# EAGLE design fingertip_16line_2 (EAGLE 9.6.2)
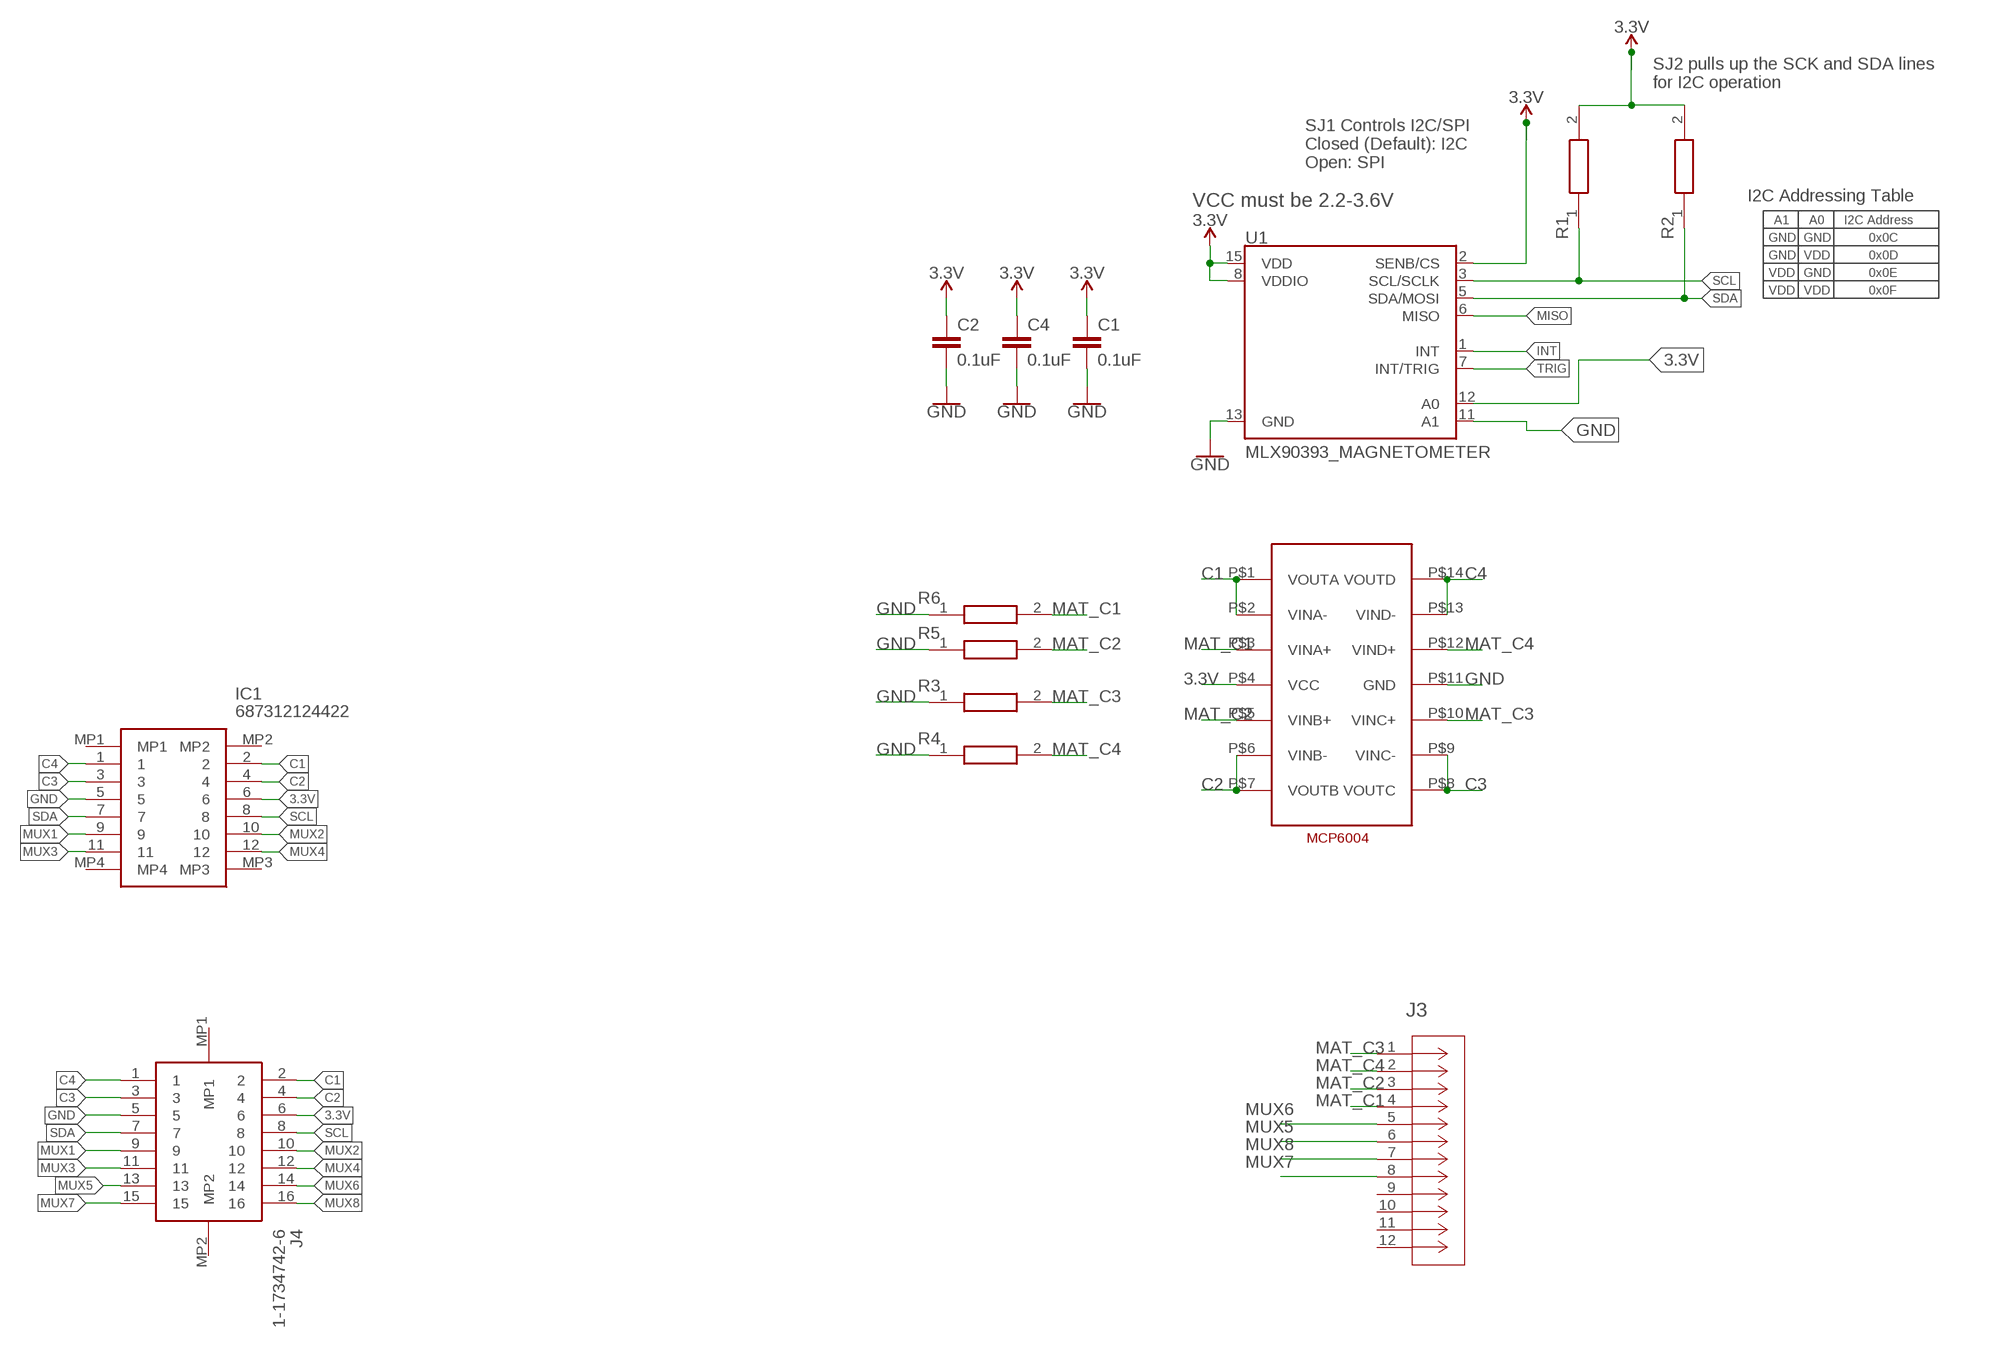
[diagram p0: schematic, sheet 1]

## Parts
C1  0.1uF  0.1UF-0402-16V-10%  [0402]
C2  0.1uF  0.1UF-0402-16V-10%  [0402]
C4  0.1uF  0.1UF-0402-16V-10%  [0402]
IC1  687312124422  [687312124422]
J3  FH12-8S-1SV(55)  [CON8_1X8_DUTB1_HRS_HIR]
J4  1-1734742-6  [117347426]
R1  ERJ-S02J103X  [RESC1005X40N]
R2  ERJ-S02J103X  [RESC1005X40N]
R3  ERJ-S02J103X  [RESC1005X40N]
R4  ERJ-S02J103X  [RESC1005X40N]
R5  ERJ-S02J103X  [RESC1005X40N]
R6  ERJ-S02J103X  [RESC1005X40N]
U1  MLX90393_MAGNETOMETER  [QFN-16_WITH_AXIES]
U$2  DECADE-MCP6004  [DECADE-MCP6003]

## Nets
3.3V: C1.1 C2.1 C4.1 IC1.6 J4.6 R1.2 R2.2 U1.2(SENB/CS) U1.8(VDDIO) U1.12(A0) U1.15(VDD) U$2.P$4(VCC)
C1: IC1.2 J4.2 U$2.P$1(VOUTA) U$2.P$2(VINA-)
C2: IC1.4 J4.4 U$2.P$6(VINB-) U$2.P$7(VOUTB)
C3: IC1.3 J4.3 U$2.P$8(VOUTC) U$2.P$9(VINC-)
C4: IC1.1 J4.1 U$2.P$13(VIND-) U$2.P$14(VOUTD)
GND: C1.2 C2.2 C4.2 IC1.5 J4.5 R3.1 R4.1 R5.1 R6.1 U1.11(A1) U1.13(GND) U$2.P$11(GND)
INT: U1.1(INT)
MAT_C1: J3.4 R6.2 U$2.P$3(VINA+)
MAT_C2: J3.3 R5.2 U$2.P$5(VINB+)
MAT_C3: J3.1 R3.2 U$2.P$10(VINC+)
MAT_C4: J3.2 R4.2 U$2.P$12(VIND+)
MISO: U1.6(MISO)
MUX1: IC1.9 J4.9
MUX2: IC1.10 J4.10
MUX3: IC1.11 J4.11
MUX4: IC1.12 J4.12
MUX5: J3.6 J4.13
MUX6: J3.5 J4.14
MUX7: J3.8 J4.15
MUX8: J3.7 J4.16
SCL: IC1.8 J4.8 R1.1 U1.3(SCL/SCLK)
SDA: IC1.7 J4.7 R2.1 U1.5(SDA/MOSI)
TRIG: U1.7(INT/TRIG)
Unconnected: IC1.MP1 IC1.MP2 IC1.MP3 IC1.MP4 J3.9 J3.10 J3.11 J3.12 J4.MP1 J4.MP2

## Notes on the sheet
- SJ2 pulls up the SCK and SDA lines
  for I2C operation
- SJ1 Controls I2C/SPI
  Closed (Default): I2C
  Open: SPI
- VCC must be 2.2-3.6V
- I2C Addressing Table
- A1 | A0 | I2C Address
- GND | GND | 0x0C
- GND | VDD | 0x0D
- VDD | GND | 0x0E
- VDD | VDD | 0x0F

## Library data of the parts
C1 C2 C4 = SparkFun-Capacitors:0.1UF: 0.1µF ceramic capacitors A capacitor is a passive two-terminal electrical component used to store electrical energy temporarily in an electric field.; PROD_ID: CAP-12416
IC1 = SamacSys_Parts:687312124422: FFC & FPC Connectors WR-FPC 0.5mm SMT ZIF 12Pin Vertical Source: Datasheet <https://katalog.we-online.de/pbs/datasheet/331031271520.pdf>; DESCRIPTION: FFC & FPC Connectors WR-FPC 0.5mm SMT ZIF 12Pin Vertical; HEIGHT: 5.5mm; MANUFACTURER_NAME: Wurth Elektronik; MANUFACTURER_PART_NUMBER: 687312124422; MOUSER_PART_NUMBER: 710-687312124422; MOUSER_PRICE-STOCK: https://www.mouser.co.uk/ProductDetail/Wurth-Elektronik/687312124422?qs=qR1qlUC5%2FYRUvnivsXiYUw%3D%3D
J3 = my-library:FH12-8S-1SV(55); BUILT_BY: EMA_Kyle; COPYRIGHT: Copyright (C) 2018 Accelerated Designs. All rights reserved; MANUFACTURER_PART_NUMBER: FH12-8S-1SV(55); SOURCELIBRARY: Hirose_2008-01-01; VENDOR: Hirose
J4 = SamacSys_Parts:1-1734742-6: TE CONNECTIVITY - 1-1734742-6 - CONNECTOR, FFC / FPC, 0.5MM, 16WAY Source: Datasheet <https://www.te.com/commerce/DocumentDelivery/DDEController?Action=showdoc&DocId=Customer Drawing1734742PpdfEnglishENG_CD_1734742_P.pdf1-1734742-6>; DESCRIPTION: TE CONNECTIVITY - 1-1734742-6 - CONNECTOR, FFC / FPC, 0.5MM, 16WAY; HEIGHT: 5.3mm; MANUFACTURER_NAME: TE Connectivity; MANUFACTURER_PART_NUMBER: 1-1734742-6; MOUSER_PART_NUMBER: 571-1-1734742-6; MOUSER_PRICE-STOCK: https://www.mouser.co.uk/ProductDetail/TE-Connectivity/1-1734742-6?qs=GQ3BsEl46pkEaYiPSkWN4w%3D%3D
R1-R6 = SamacSys_Parts:ERJ-S02J103X: Thick Film Resistors - SMD 0402 10Kohms 5% Anti-Sulfur Source: Datasheet <https://industrial.panasonic.com/cdbs/www-data/pdf/RDP0000/AOA0000C334.pdf>; DESCRIPTION: Thick Film Resistors - SMD 0402 10Kohms 5% Anti-Sulfur; HEIGHT: 0.4mm; MANUFACTURER_NAME: Panasonic; MANUFACTURER_PART_NUMBER: ERJ-S02J103X
U1 = SparkFun-Sensors:MLX90393_MAGNETOMETER; PROD_ID: SEN-13886
U$2 = DECADE-libraries20151104:DECADE-MCP6004

## Board
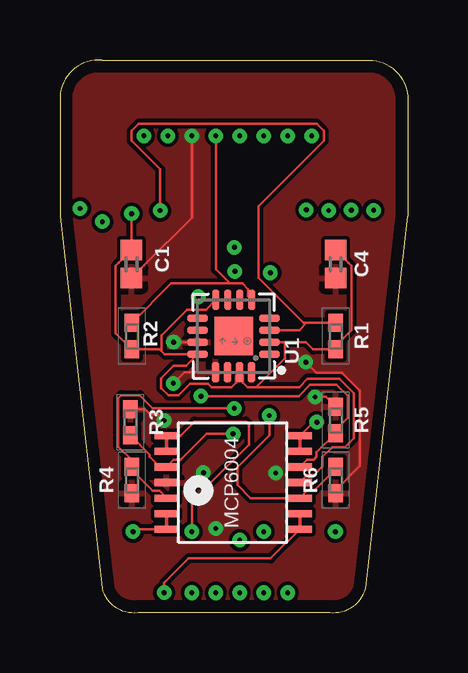
[diagram p1: board, top side]
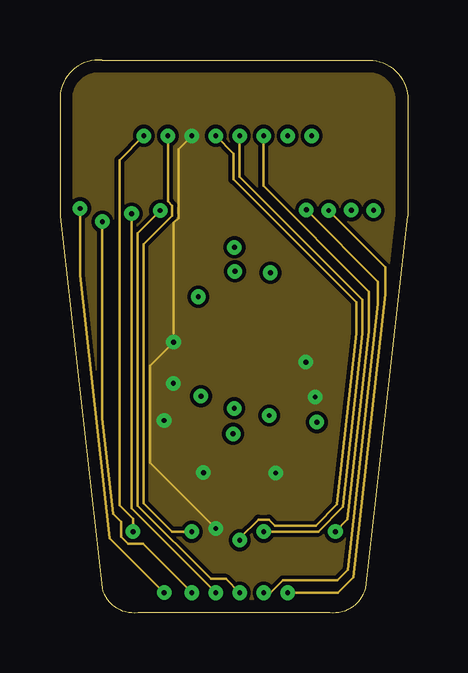
[diagram p2: board, inner layer Route2]
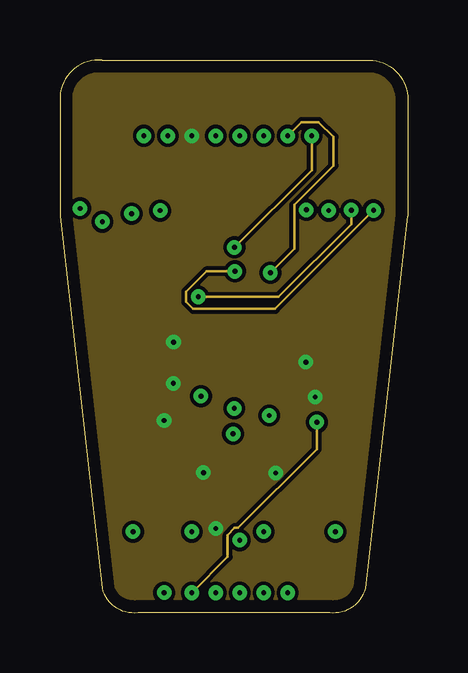
[diagram p3: board, inner layer Route15]
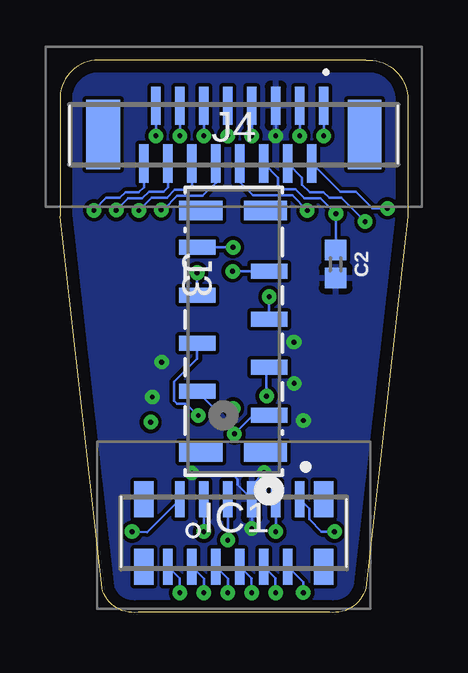
[diagram p4: board, bottom side, seen from below]

Size 14.5 x 23.02 mm. Coordinates in mm from the lower left corner, seen from the top.
Outline: 1.75,23.02 12.75,23.02 arc-90 14.5,21.52 14.5,16.52 12.75,1.02 arc-83 11.25,0.01 3.25,0.01 arc-83 1.75,1.02 0,16.52 0,21.52 arc-90 1.75,23.02
Copper layers (1+2*15+16): Top 0.035mm / dielectric 0.2mm / Route2 0.0175mm / dielectric 1.065mm / Route15 0.0175mm / dielectric 0.2mm / Bottom 0.035mm
Design rules "default *": minimum track width 0.1mm, minimum drill 0.2mm, track to track 6mil, track to pad 6mil, pad to pad 6mil, via to via 6mil, smd to smd 6mil, copper to edge 20mil, drill to drill 6mil, minimum pad ring 10mil, minimum via ring 8mil, stop-mask expansion 4mil, vias tented up to drill 0mil, thermal gap 10mil

### Footprints (pad centres in the part's own frame; a part is rotated, then mirrored left to right if it is on the bottom)
0402 = smd 0.85 x 0.9: 1 -0.58,0; 2 0.58,0
687312124422 = smd 0.4 x 1.5: 1 -2.75,-1.4; 2 -2.25,1.4; 3 -1.75,-1.4; 4 -1.25,1.4; 5 -0.75,-1.4; 6 -0.25,1.4; 7 0.25,-1.4; 8 0.75,1.4; 9 1.25,-1.4; 10 1.75,1.4; 11 2.25,-1.4; 12 2.75,1.4 | smd 0.8 x 1.5: MP1 -3.75,-1.4; MP2 -3.75,1.4; MP3 3.75,1.4; MP4 3.75,-1.4
CON8_1X8_DUTB1_HRS_HIR = smd 0.61 x 1.524: 1 3.5,1.473; 2 2.5,-1.524; 3 1.5,1.473; 4 0.5,-1.524; 5 -0.5,1.473; 6 -1.5,-1.524; 7 -2.5,1.473; 8 -3.5,-1.524 | smd 0.813 x 1.803: 9 -5.029,-1.372; 10 5.029,-1.372; 11 -5.029,1.321; 12 5.029,1.321
117347426 = smd 0.4 x 1.6: 1 -3.75,-1.2; 2 -3.25,1.2; 3 -2.75,-1.2; 4 -2.25,1.2; 5 -1.75,-1.2; 6 -1.25,1.2; 7 -0.75,-1.2; 8 -0.25,1.2; 9 0.25,-1.2; 10 0.75,1.2; 11 1.25,-1.2; 12 1.75,1.2; 13 2.25,-1.2; 14 2.75,1.2; 15 3.25,-1.2; 16 3.75,1.2 | smd 1.4 x 2.9: MP1 -5.45,0; MP2 5.45,0
RESC1005X40N = smd 0.75 x 0.6: 1 -0.55,0; 2 0.55,0
QFN-16_WITH_AXIES = smd 0.3 x 0.85: 1 0.754,1.498; 2 0.254,1.498; 3 -0.246,1.498; 4 -0.746,1.498; 9 -0.746,-1.506; 10 -0.246,-1.506; 11 0.254,-1.506; 12 0.754,-1.506 | smd 0.85 x 0.3: 5 -1.508,0.746; 6 -1.508,0.246; 7 -1.508,-0.254; 8 -1.508,-0.754; 13 1.496,-0.764; 14 1.496,-0.264; 15 1.496,0.236; 16 1.496,0.736 | smd 1.6 x 1.6: 17 0,0
DECADE-MCP6003 = smd 1 x 0.3: P$1 2.75,-2.05; P$2 2.75,-1.4; P$3 2.75,-0.75; P$4 2.75,-0.1; P$5 2.75,0.55; P$6 2.75,1.2; P$7 2.75,1.85; P$8 -2.8,1.85; P$9 -2.8,1.2; P$10 -2.8,0.55; P$11 -2.8,-0.1; P$12 -2.8,-0.75; P$13 -2.8,-1.4; P$14 -2.8,-2.05

### Placement (x,y rotation side)
C1  2.99,14.52 270 top
C2  3,14.52 270 bottom
C4  11.5,14.52 270 top
IC1  7.25,3.32 180 bottom
J3  7.25,11.72 270 bottom
J4  7.25,19.92 180 bottom
R1  11.5,11.52 270 top
R2  3,11.52 270 top
R3  2.94,7.93 270 top
R4  3,5.52 90 top
R5  11.5,8.02 270 top
R6  11.5,5.52 90 top
U1  7.25,11.52 270 top
U$2  7.25,5.52 0 top

### Tracks (layer width: path | path; a pad name or v marks a point on that pad's centre or on a via)
3.3V  (via drill 0.2)
  Top 0.102: 9.39,11.26 10.26,11.26 10.56,10.97 R1.2 11.5,11.1 12.15,11.76 12.15,14.45 12.03,14.56 C4.1 | 9.39,11.26 U1.2 | 8.17,9.39 8.05,9.39 7.82,9.39 7.63,9.58 7.63,9.87 U1.15 7.34,9.87 7.34,9.58 7.15,9.39 6.32,9.39 6.19,9.52 5.42,9.52 4.94,9.04 4.52,9.04 4.22,9.34 4.22,9.76 4.74,10.27 5.26,10.27 U1.12 4.37,10.76 4.22,10.91 | 8.17,9.39 9.38,10.59 9.38,11.25 9.39,11.26 | 4.22,10.91 4.16,10.97 R2.2 2.33,11.63 2.33,14.45 2.45,14.56 C1.1 v2.99,16.61 v2.99,16.62 | U1.8 6.09,12.62 5.3,12.62 4.23,11.55 4.23,10.92 4.22,10.91 | U$2.P$4 10.3,5.71 10.58,5.71 10.96,6.09 10.96,6.49 11.36,6.89 11.88,6.89 12.26,7.26 12.26,9.13 11.65,9.74 10.33,9.74 9.98,9.39 8.17,9.39
  Route2 0.102: v6.5,0.82 2.99,4.34 v2.99,16.62
  Bottom 0.102: J4.6 5.4,18.12 5.4,17.83 5.2,17.63 4.67,17.63 4.3,17.25 3.63,17.25 v2.99,16.62 v3,16.61 C2.1 | IC1.6 6.51,1.42 v6.5,0.82
C1  (via drill 0.2)
  Top 0.102: U$2.P$1 8.79,2.26 5.36,2.26 4.35,1.25 v4.35,0.83
  Top 0.152: U$2.P$2 U$2.P$1
  Route2 0.102: v4.35,0.83 2.08,3.1 0.84,14.06 v0.84,16.84
  Bottom 0.102: J4.2 2.81,17.53 2.15,17.53 1.46,16.84 v0.84,16.84 | IC1.2 4.35,1.27 v4.35,0.83
C2  (via drill 0.2)
  Top 0.102: 10.03,7.4 10.56,7.93 v10.72,7.93
  Top 0.152: U$2.P$6 U$2.P$7 10.03,7.4
  Route2 0.102: v1.77,16.29 1.77,8.08 2.22,4.12 2.54,3.79 2.54,3.16 2.84,2.86 3.47,2.86 v5.5,0.82
  Route15 0.102: v5.5,0.82 6.99,2.32 6.99,3.23 7.29,3.52 7.43,3.52 10.72,6.81 v10.72,7.93
  Bottom 0.102: J4.4 4.4,18.12 4.4,17.83 4.08,17.51 3.5,17.51 3.27,17.27 2.76,17.27 v1.77,16.29 | IC1.4 5.51,1.42 v5.5,0.82
C3  (via drill 0.2)
  Top 0.102: U$2.P$8 5.03,7.37 5.62,7.95 7.76,7.95 7.88,7.84 7.88,7 6.2,5.32 5.62,5.32 5.5,5.2 v5.5,3.37
  Top 0.152: U$2.P$8 U$2.P$9
  Route2 0.102: v5.5,3.37 4.69,3.37 3.5,4.55 3.5,15.35 4.69,16.54 4.69,16.96 4.5,17.14 v4.5,19.86
  Bottom 0.102: J4.3 v4.5,19.86 | IC1.3 v5.5,3.37
C4  (via drill 0.2)
  Top 0.102: U$2.P$14 3.15,3.47 v3.05,3.37
  Top 0.152: U$2.P$13 U$2.P$14
  Route2 0.102: v3.05,3.37 3.05,3.91 2.48,4.48 2.48,18.84 v3.5,19.86
  Bottom 0.102: J4.1 v3.5,19.86 | IC1.1 4.1,4.32 4.1,3.88 3.59,3.37 v3.05,3.37
GND  (via drill 0.2)
  Top 0.102: U1.11 | U1.11 v4.74,11.26 | C1.2 3.52,14.47 5.5,16.45 v5.5,19.86 | U1.13 5.2,10.02 v4.73,9.55 | U$2.P$11 4.32,5.42 | R5.1 11.09,8.98 v10.64,8.98 | R3.1 3.54,8.48 3.76,8.26 4.09,8.26 v4.34,8 | v10.26,10.43 10.69,10 11.75,10 12.51,9.24 12.51,6.12 11.5,5.1 R6.1
  Route2 0.102: v6.5,3.5 3.76,6.24 3.76,10.28 v4.74,11.26 4.74,16.23 4.94,16.43 4.94,19.3 v5.5,19.86
  Bottom 0.102: J4.5 v5.5,19.86 | IC1.5 v6.5,3.5 | IC1.5 7.1,5.31 7.1,5.55 7.36,5.81 v9,5.81 | IC1.5 6.5,5.31 v5.99,5.83
  pour Top: 0.12,22.83 0.12,2.53 2.64,0.01 11.96,0.01 14.03,2.08 14.83,2.89 14.83,24.03 1.27,24.03 0.11,22.86
  pour Route15: 0.03,22.33 0.03,2.03 2.55,-0.5 11.87,-0.5 14.74,2.38 14.74,23.52 1.18,23.52 0.02,22.36
  pour Bottom: -0.07,22.31 -0.07,2.01 2.45,-0.51 11.77,-0.51 14.64,2.36 14.64,23.5 1.08,23.5 -0.08,22.34
  pour Route2: -0.11,22.36 -0.11,2.06 2.42,-0.46 11.73,-0.46 14.61,2.41 14.61,23.55 1.05,23.55 -0.11,22.39
MAT_C1  (via drill 0.2)
  Top 0.102: R6.2 11.5,5.93 11.45,5.93 10.58,5.06 10.3,5.06 U$2.P$3 7.95,4.77 7.4,5.32 7.4,6.06 8.73,7.39 v8.73,8.2 v8.73,8.21
  Bottom 0.102: J3.4 8.77,10.57 9.74,9.61 9.74,8.83 9.62,8.71 9.23,8.71 v8.73,8.21
MAT_C2  (via drill 0.2)
  Top 0.102: U$2.P$5 10.3,6.36 10.58,6.36 10.7,6.48 10.7,6.67 R5.2 11.5,7.6 12,8.11 12,9.03 11.54,9.49 10.44,9.49 9.96,9.02 v5.88,9.02
  Bottom 0.102: J3.3 5.88,10.11 v5.88,9.02
MAT_C3  (via drill 0.2)
  Top 0.102: R3.2 3.75,6.57 3.75,6.48 4.16,6.07 U$2.P$10 4.75,6.36 5.03,6.36 6.12,7.45 v7.22,7.45
  Bottom 0.102: J3.1 6.45,8.22 v7.22,7.45
MAT_C4  (via drill 0.2)
  Top 0.102: 3,5.93 R4.2 3,6.35 2.44,6.92 2.44,8.93 2.55,9.05 3.32,9.05 3.87,8.51 v7.27,8.51 | U$2.P$12 4.15,5.06 3.87,5.06 3,5.93 | 3,5.93
  Bottom 0.102: J3.2 8.06,8.51 v7.27,8.51
MUX1  (via drill 0.2)
  Route2 0.102: v8.5,3.37 10.77,3.37 11.8,4.4 12.62,11.63 12.62,13.03 7.49,18.16 v7.49,19.85 v7.5,19.86
  Bottom 0.102: J4.9 v7.5,19.86 | IC1.9 v8.5,3.37
MUX2  (via drill 0.2)
  Route2 0.102: v8.5,0.82 8.79,0.83 9.3,1.33 11.56,1.33 12.02,1.79 13.27,12.86 13.27,13.79 v10.28,16.78
  Bottom 0.102: J4.10 8,17.91 8.55,17.36 9.61,17.36 10.19,16.78 v10.28,16.78 | IC1.10 8.5,1.42 v8.5,0.82
MUX3  (via drill 0.2)
  Route2 0.102: v11.49,3.37 12,3.88 12.89,11.73 12.89,13.37 8.48,17.78 8.48,19.84 v8.5,19.86
  Bottom 0.102: J4.11 v8.5,19.86 | IC1.11 10.87,3.35 v11.49,3.37
MUX4  (via drill 0.2)
  Route2 0.102: v9.5,0.82 11.6,0.83 12.24,1.47 13.57,13.26 13.57,14.39 v11.21,16.75
  Bottom 0.102: J4.12 9,17.76 9.15,17.61 9.71,17.61 10.04,17.28 10.67,17.28 v11.21,16.75 | IC1.12 9.51,1.42 v9.5,0.82
MUX5  (via drill 0.2)
  Route15 0.102: v8.78,14.16 9.77,15.15 9.77,16.99 11.41,18.62 11.41,19.82 10.79,20.44 10.08,20.44 v9.5,19.86
  Bottom 0.102: J4.13 v9.5,19.86 | J3.6 v8.77,14.15 v8.78,14.16
MUX6  (via drill 0.2)
  Route15 0.102: v5.77,13.16 9.12,13.16 12.15,16.19 v12.15,16.77
  Bottom 0.102: J4.14 10,17.72 10.18,17.54 10.78,17.54 11.06,17.25 11.66,17.25 v12.15,16.77 | J3.5 v5.78,13.15 v5.77,13.16
MUX7  (via drill 0.2)
  Route15 0.102: v7.28,15.22 10.5,18.44 v10.5,19.86
  Bottom 0.102: J4.15 v10.5,19.86 | J3.8 v7.28,15.22
MUX8  (via drill 0.2)
  Route15 0.102: v7.3,14.22 6.11,14.22 5.26,13.37 5.26,12.95 5.56,12.65 8.97,12.65 v13.08,16.76
  Bottom 0.102: J4.16 11,17.73 11.22,17.51 11.77,17.51 12,17.27 12.56,17.27 v13.08,16.76 | J3.7 v7.3,14.22
SCL  (via drill 0.2)
  Top 0.102: U1.3 9.99,11.76 10.29,12.07 R1.1 10.15,12.07 8.27,13.95 8.27,16.92 11.01,19.65 11.01,20.07 10.71,20.37 3.29,20.37 2.99,20.07 2.99,19.65 4.18,18.46 v4.18,16.75
  Route2 0.102: v7.5,0.82 6.93,1.4 6.3,1.4 3.24,4.45 3.24,15.81 v4.18,16.75
  Bottom 0.102: J4.8 7,17.94 6.44,17.38 4.81,17.38 v4.18,16.75 | IC1.8 7.5,1.41 v7.5,0.82
SDA  (via drill 0.2)
  Top 0.102: U1.5 7.85,13.17 7.85,13.47 7.61,13.71 7.09,13.71 | 7.09,13.71 6.5,14.3 v6.5,19.86 | R2.1 4.64,13.71 7.09,13.71
  Route2 0.102: v7.5,3.02 v7.51,3.03 7.51,3.11 8.28,3.87 8.71,3.87 8.96,3.62 10.67,3.62 11.56,4.51 12.37,11.64 12.37,12.92 7.24,18.05 7.24,19.12 v6.5,19.86
  Bottom 0.102: J4.7 v6.5,19.86 | IC1.7 v7.5,3.02